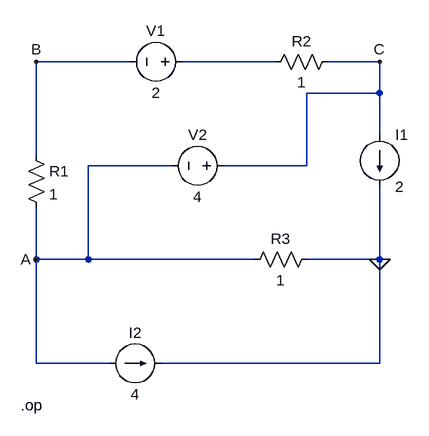
[diagram p0: schematic MainCircuit.asc]
MainCircuit.asc, the LTspice schematic file:
Version 4
SHEET 1 880 680
WIRE 112 16 -32 16
WIRE 336 16 192 16
WIRE 496 16 416 16
WIRE 496 64 496 16
WIRE 496 64 384 64
WIRE 496 128 496 64
WIRE -32 160 -32 16
WIRE 176 176 48 176
WIRE 384 176 384 64
WIRE 384 176 256 176
WIRE -32 320 -32 240
WIRE 48 320 48 176
WIRE 48 320 -32 320
WIRE 304 320 48 320
WIRE 496 320 496 208
WIRE 496 320 384 320
WIRE -32 480 -32 320
WIRE 80 480 -32 480
WIRE 496 480 496 320
WIRE 496 480 160 480
FLAG 496 320 0
FLAG -32 320 A
FLAG -32 16 B
FLAG 496 16 C
SYMBOL res -48 144 R0
SYMATTR InstName R1
SYMATTR Value 1
SYMBOL voltage 208 16 R90
WINDOW 0 -32 56 VBottom 2
WINDOW 3 32 56 VTop 2
SYMATTR InstName V1
SYMATTR Value 2
SYMBOL res 432 0 R90
WINDOW 0 0 56 VBottom 2
WINDOW 3 32 56 VTop 2
SYMATTR InstName R2
SYMATTR Value 1
SYMBOL voltage 272 176 R90
WINDOW 0 -32 56 VBottom 2
WINDOW 3 32 56 VTop 2
SYMATTR InstName V2
SYMATTR Value 4
SYMBOL res 400 304 R90
WINDOW 0 0 56 VBottom 2
WINDOW 3 32 56 VTop 2
SYMATTR InstName R3
SYMATTR Value 1
SYMBOL current 496 128 R0
SYMATTR InstName I1
SYMATTR Value 2
SYMBOL current 80 480 R270
WINDOW 0 32 40 VTop 2
WINDOW 3 -32 40 VBottom 2
SYMATTR InstName I2
SYMATTR Value 4
TEXT -56 544 Left 2 !.op

The netlist it stands for:
* MainCircuit.asc
R1 B A 1
V1 N001 B 2
R2 C N001 1
V2 C A 4
R3 0 A 1
I1 C 0 2
I2 A 0 4
.op
.backanno
.end